# Altium schematic sheet led.SchDoc
size A4; SheetNumber: 1; SheetTotal: 1
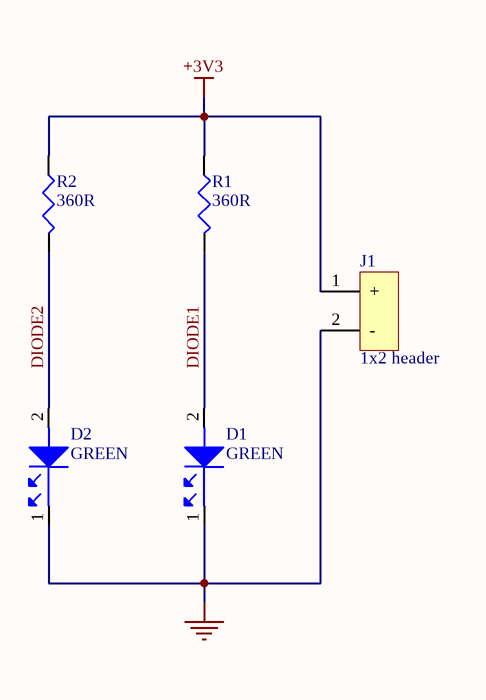
[diagram p0: led.SchDoc]

## Parts
D1  GREEN  [LED0603G]
D2  GREEN  [LED0603G]
J1  1x2 header  [HDR1X2]
R1  360R  [R0805]
R2  360R  [R0805]

## Nets
+3V3: J1.1(+) R1.1 R2.1
GND: D1.1 D2.1 J1.2(-)
DIODE1: D1.2 R1.2
DIODE2: D2.2 R2.2

## Library data of the parts
D1 D2 = LTST-C193KGKT-5A: Single Color LED, Green, Water Clear, 1.15mm; Manufacturer: Vishay Lite-On; Shape: Rectangular; Forward Current: 30mA; Luminous Intensity-Nom: 16.25mcd; Channels: 1; Viewing Angle: 130°; Overall Height: 0.35mm; Supplier: Digi-Key; Supplier Part Number: 160-1828-1-ND; Manufacturer Part Number: LTST-C193KGKT-5A; RoHS: Yes; Category: Optoelectronics; Stock: 211088; Pricing: 1=0.37, 10=0.201, 100=0.0933, 500=0.08612, 1000=0.06745, 2000=0.06602 (USD); Mounting Technology: Surface Mount; Pins: 2; Terminal Finish: Tin; Color: Green; Min Operating Temperature: -55°C; Max Operating Temperature: 85°C; JESD-609 Code: e3; Packaging: Tape and Reel; Lens Style: WATER CLEAR; Optoelectronic Device Type: SINGLE COLOR LED; Size: 1.15mm; Terminal Pitch: 1.5mm; RoHS Compliant: Yes; Reach SVHC Compliant: Yes; ComponentLink1URL: https://datasheet.ciiva.com:443/pdfs/VipMasterIC/IC/LITE/LITE-S-A0009748466/LITE-S-A0009831315-1.pdf?src-supplier=IHS+Markit; ComponentLink1Description: https://datasheet.ciiva.com:443/pdfs/VipMasterIC/IC/LITE/LITE-S-A0009748466/LITE-S-A0009831315-1.pdf?src-supplier=IHS+Markit; ComponentLink2URL: https://datasheet.ciiva.com/11773/0900766b80dc0550-11773612.pdf?src-supplier=Rs; ComponentLink2Description: https://datasheet.ciiva.com/11773/0900766b80dc0550-11773612.pdf?src-supplier=Rs; ComponentLink3URL: https://datasheet.ciiva.com/12400/ltst-c193-series-201756-12400795.pdf?src-supplier=Mouser; ComponentLink3Description: https://datasheet.ciiva.com/12400/ltst-c193-series-201756-12400795.pdf?src-supplier=Mouser; ComponentLink4URL: https://datasheet.ciiva.com/2110/s-110-ltst-c193kgkt-5a-2110268.pdf?src-supplier=Digi-Key; ComponentLink4Description: https://datasheet.ciiva.com/2110/s-110-ltst-c193kgkt-5a-2110268.pdf?src-supplier=Digi-Key; ComponentLink5URL: https://datasheet.ciiva.com/2110/s-110-ltst-c193kgkt-5a-2110267.pdf?src-supplier=Digi-Key; ComponentLink5Description: https://datasheet.ciiva.com/2110/s-110-ltst-c193kgkt-5a-2110267.pdf?src-supplier=Digi-Key; ComponentLink6URL: https://datasheet.ciiva.com/2110/s-110-ltst-c193kgkt-5a-2110269.pdf?src-supplier=Digi-Key; ComponentLink6Description: https://datasheet.ciiva.com/2110/s-110-ltst-c193kgkt-5a-2110269.pdf?src-supplier=Digi-Key; ComponentLink7URL: https://datasheet.ciiva.com/16444/ltst-c193kgkt-5a-16444759.pdf?src-supplier=Future+Electronics; ComponentLink7Description: https://datasheet.ciiva.com/16444/ltst-c193kgkt-5a-16444759.pdf?src-supplier=Future+Electronics
J1 = 0022292021 (2): Board Connector, 2 Contact(s), 1 Row(s), Male, Straight, Solder Terminal; Manufacturer: Molex; Manufacturer Part Number: 0022292021; RoHS: No; Stock: 151179; Pricing: 1=0.51, 10=0.427, 100=0.3324, 1000=0.26114, 5000=0.22949, 10000=0.21366 (USD); Supplier: Digi-Key; Supplier Part Number: WM2744-ND; Category: Connectors
R1 R2 = CRCW0805360RFKEA: Fixed Resistor, Metal Glaze/thick Film, 0.125W, 360ohm, 150V, 1% +/-Tol, 100ppm/Cel, Surface Mount, 0805; Manufacturer: Vishay; Power: 125mW; Rated Temperature: 70°C; Temperature Coefficient: 100ppm/°C; Package Height: 0.45mm; Package Length: 2mm; Package Width: 1.25mm; Reference Standard: AEC-Q200; Supplier: Digi-Key; Supplier Part Number: 541-360CCT-ND; Manufacturer Part Number: CRCW0805360RFKEA; RoHS: Yes; Category: Resistors; Stock: 29636; Pricing: 1=0.1, 10=0.038, 50=0.0244, 100=0.0206, 500=0.01434, 1000=0.01248 (USD); Mounting Technology: Surface Mount; Pins: 2; Package Shape: Rectangular; Case/Package: 0805; Terminal Finish: Nickel; Min Operating Temperature: -55°C; Max Operating Temperature: 155°C; Tolerance: 1%; JESD-609 Code: e3; Resistor Type: FIXED RESISTOR; Construction: Chip; Package Style: SMTMeter; Packaging: Tape and Reel; Value: 360R; Technology: METAL GLAZE/THICK FILM; Termination: Wraparound; Working Voltage: 150V; Reach SVHC Compliant: Yes; RoHS Compliant: Yes; ComponentLink1URL: https://datasheet.ciiva.com:443/pdfs/VipMasterIC/IC/VISH/VISH-S-A0007266705/VISH-S-A0007266705-1.pdf?src-supplier=IHS+Markit; ComponentLink1Description: https://datasheet.ciiva.com:443/pdfs/VipMasterIC/IC/VISH/VISH-S-A0007266705/VISH-S-A0007266705-1.pdf?src-supplier=IHS+Markit; ComponentLink2URL: https://datasheet.ciiva.com/2467/dcrcwe3-2467773.pdf?src-supplier=Digi-Key; ComponentLink2Description: https://datasheet.ciiva.com/2467/dcrcwe3-2467773.pdf?src-supplier=Digi-Key